# Altium schematic sheet SERVO.SchDoc: =ProjectName
size A4; CheckedBy: DatNB; Author: Ven; CompanyName: Nacentech; Organization: IMET
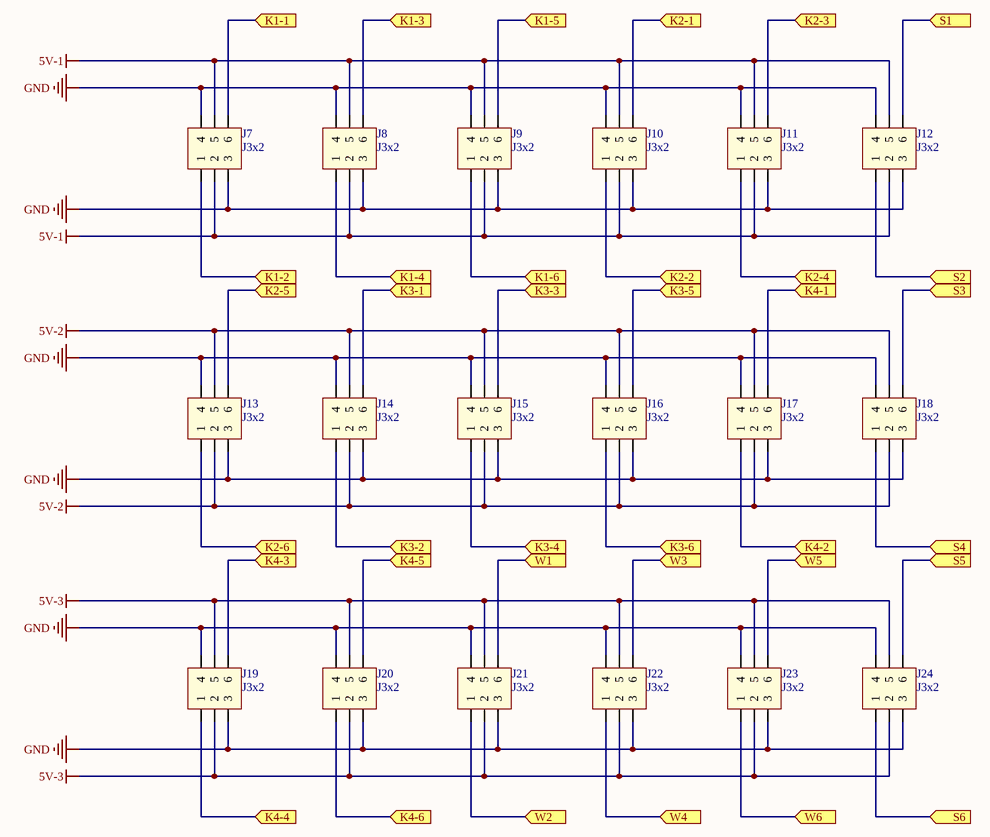
[diagram p0: SERVO.SchDoc]

## Parts
J7  J3x2  [J3-D2T]
J8  J3x2  [J3-D2T]
J9  J3x2  [J3-D2T]
J10  J3x2  [J3-D2T]
J11  J3x2  [J3-D2T]
J12  J3x2  [J3-D2T]
J13  J3x2  [J3-D2T]
J14  J3x2  [J3-D2T]
J15  J3x2  [J3-D2T]
J16  J3x2  [J3-D2T]
J17  J3x2  [J3-D2T]
J18  J3x2  [J3-D2T]
J19  J3x2  [J3-D2T]
J20  J3x2  [J3-D2T]
J21  J3x2  [J3-D2T]
J22  J3x2  [J3-D2T]
J23  J3x2  [J3-D2T]
J24  J3x2  [J3-D2T]

## Ports
K1-1 (in), K1-2 (in), K1-3 (in), K1-4 (in), K1-5 (in), K1-6 (in), K2-1 (in), K2-2 (in), K2-3 (in), K2-4 (in), K2-5 (in), K2-6 (in), K3-1 (in), K3-2 (in), K3-3 (in), K3-4 (in), K3-5 (in), K3-6 (in), K4-1 (in), K4-2 (in), K4-3 (in), K4-4 (in), K4-5 (in), K4-6 (in), S1 (in), S2 (in), S3 (in), S4 (in), S5 (in), S6 (in), W1 (in), W2 (in), W3 (in), W4 (in), W5 (in), W6 (in)

## Nets
5V-1: J7.2 J7.5 J8.2 J8.5 J9.2 J9.5 J10.2 J10.5 J11.2 J11.5 J12.2 J12.5
5V-2: J13.2 J13.5 J14.2 J14.5 J15.2 J15.5 J16.2 J16.5 J17.2 J17.5 J18.2 J18.5
5V-3: J19.2 J19.5 J20.2 J20.5 J21.2 J21.5 J22.2 J22.5 J23.2 J23.5 J24.2 J24.5
GND: J7.3 J7.4 J8.3 J8.4 J9.3 J9.4 J10.3 J10.4 J11.3 J11.4 J12.3 J12.4 J13.3 J13.4 J14.3 J14.4 J15.3 J15.4 J16.3 J16.4 J17.3 J17.4 J18.3 J18.4 J19.3 J19.4 J20.3 J20.4 J21.3 J21.4 J22.3 J22.4 J23.3 J23.4 J24.3 J24.4
K1-1: J7.6 ; port K1-1
K1-2: J7.1 ; port K1-2
K1-3: J8.6 ; port K1-3
K1-4: J8.1 ; port K1-4
K1-5: J9.6 ; port K1-5
K1-6: J9.1 ; port K1-6
K2-1: J10.6 ; port K2-1
K2-2: J10.1 ; port K2-2
K2-3: J11.6 ; port K2-3
K2-4: J11.1 ; port K2-4
K2-5: J13.6 ; port K2-5
K2-6: J13.1 ; port K2-6
K3-1: J14.6 ; port K3-1
K3-2: J14.1 ; port K3-2
K3-3: J15.6 ; port K3-3
K3-4: J15.1 ; port K3-4
K3-5: J16.6 ; port K3-5
K3-6: J16.1 ; port K3-6
K4-1: J17.6 ; port K4-1
K4-2: J17.1 ; port K4-2
K4-3: J19.6 ; port K4-3
K4-4: J19.1 ; port K4-4
K4-5: J20.6 ; port K4-5
K4-6: J20.1 ; port K4-6
S1: J12.6 ; port S1
S2: J12.1 ; port S2
S3: J18.6 ; port S3
S4: J18.1 ; port S4
S5: J24.6 ; port S5
S6: J24.1 ; port S6
W1: J21.6 ; port W1
W2: J21.1 ; port W2
W3: J22.6 ; port W3
W4: J22.1 ; port W4
W5: J23.6 ; port W5
W6: J23.1 ; port W6

## Notes on the sheet
- Project:
- Page Contents:
- Size:
- Date:
- A4
- Checked by:
- Time:
- Revision:
- Sheet
- of
- File:

## Library data of the parts
J7-J24 = JP3x2: Connector 3x2; Value: Connector 3x2